# Altium schematic sheet Main.SchDoc: Top level
size A3; Organization: Use Organization_Name in ProjParam; Address1: Eliot Ferragni; Address2: STI-MOBOTS; Address3: EPFL; Address4: CH-1015 LAUSANNE; DocumentNumber: 1; Revision: A; SheetNumber: 1; SheetTotal: 11; ApprovedBy: Init ApprovedBy in DocParam; CheckedBy: Init CheckedBy in DocParam; Author: Init Author in DocParam; CompanyName: Init CompanyName in DocParam; DrawnBy: Init DrawBy in DocParam; Engineer: Init Engineer in DocParam; Title2: Top level interconnections view; DocumentName: Init DocumentName in DocParam; ProjectName: Init ProjectName in DocParam
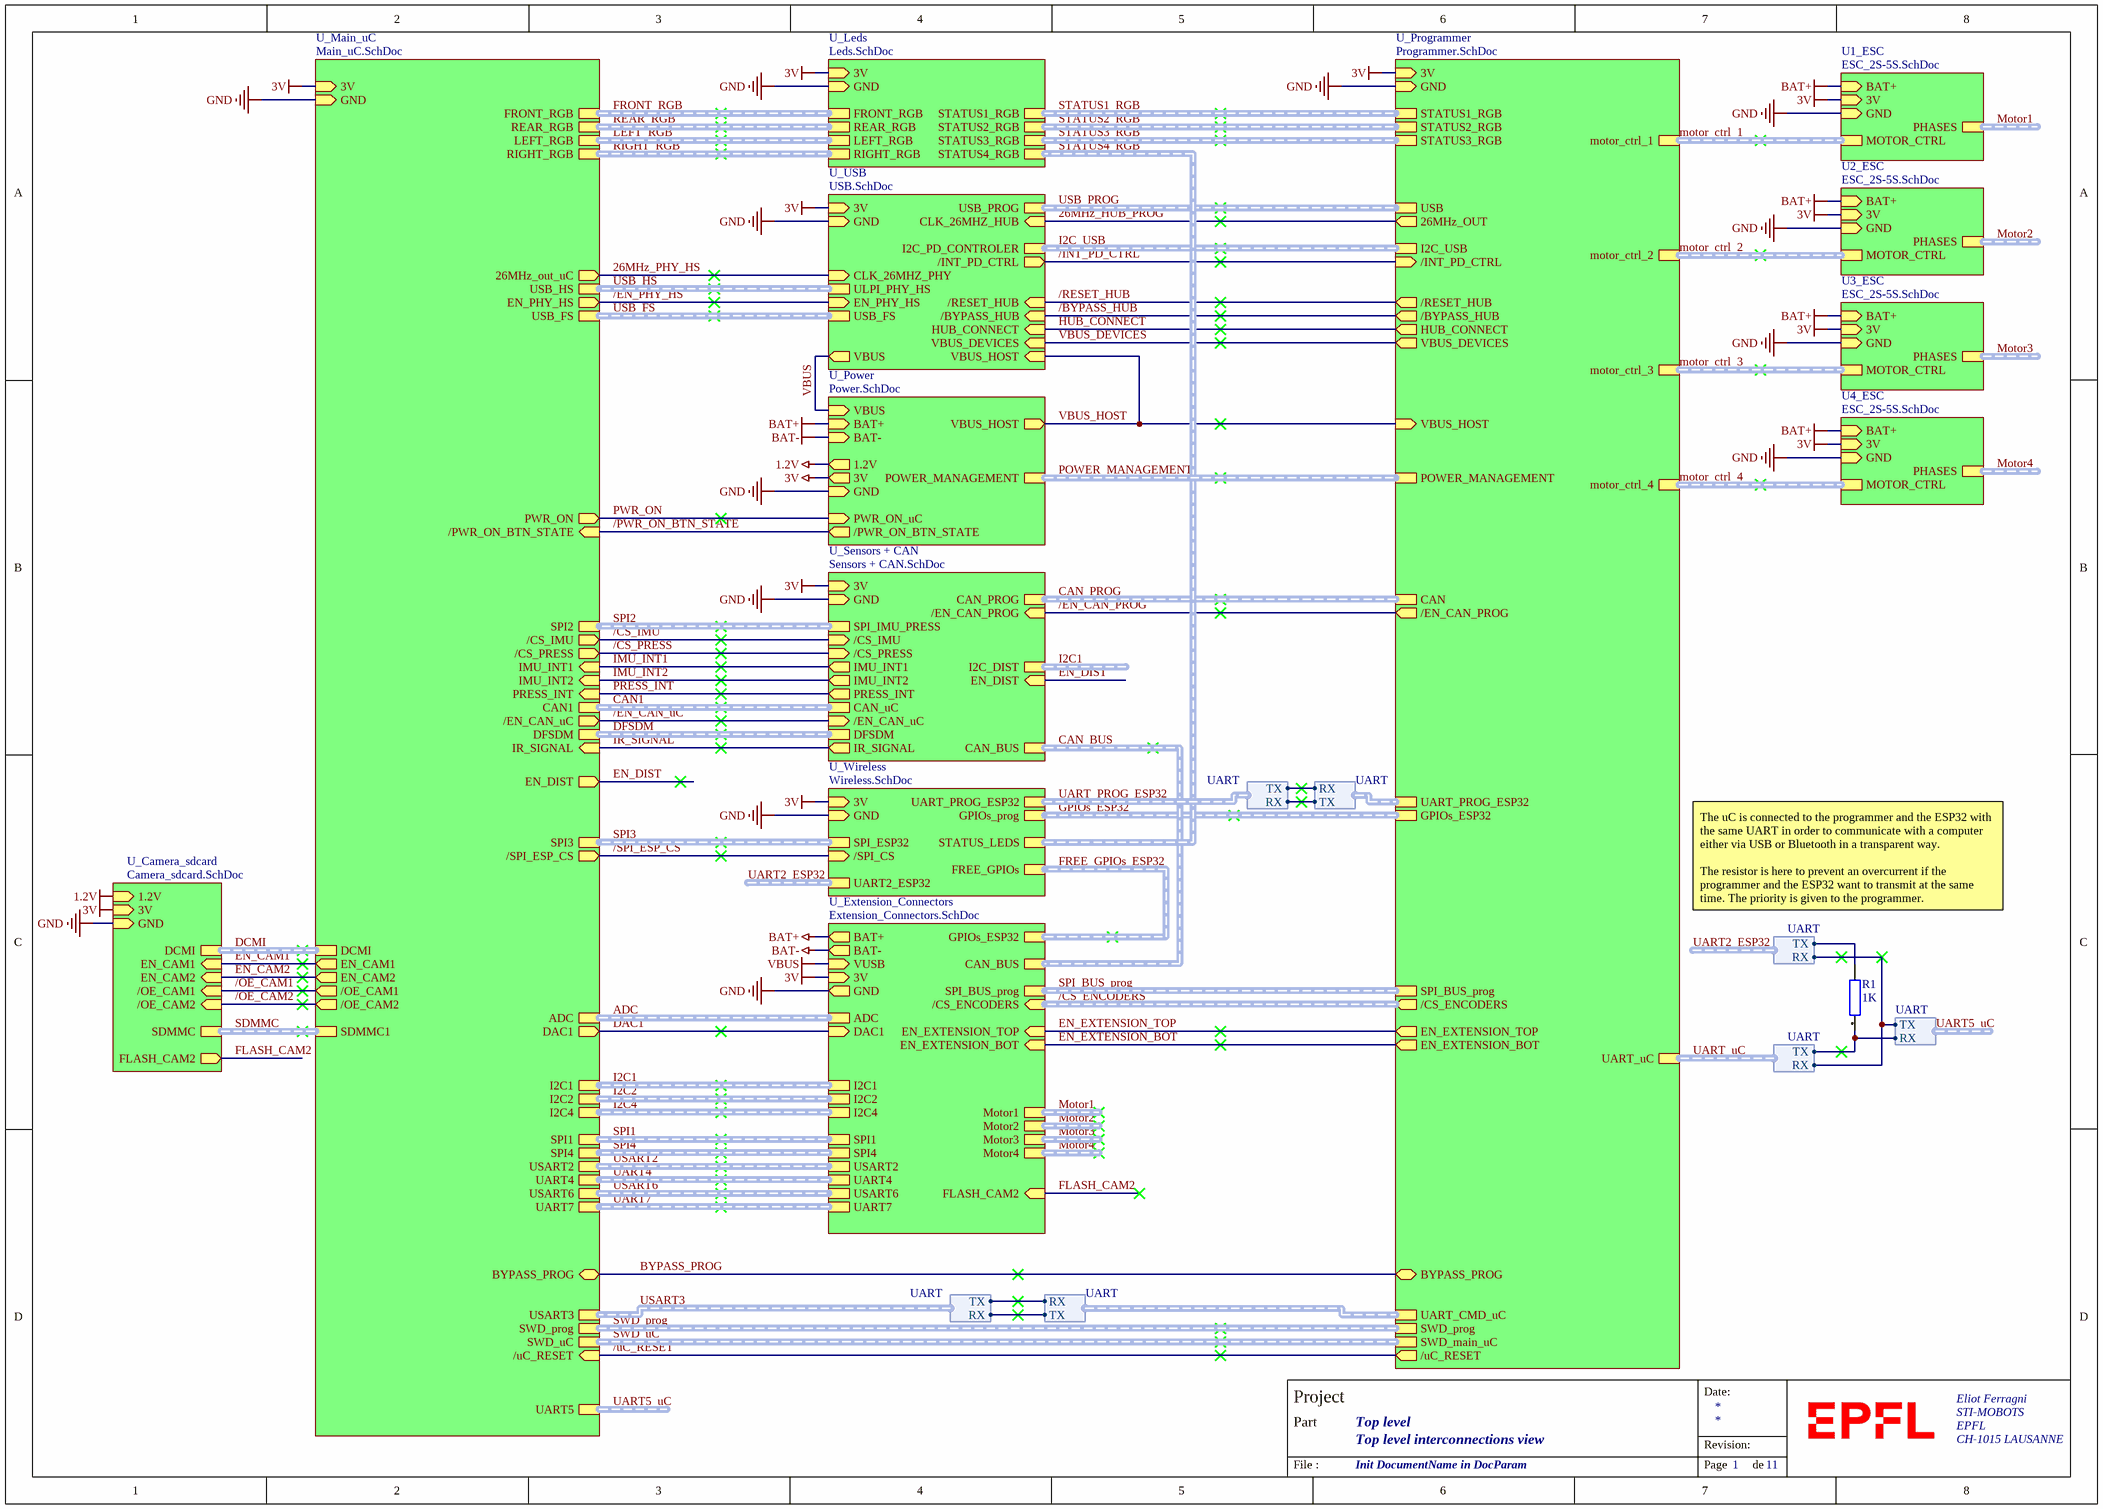
[diagram p0: Main.SchDoc]

## Parts
R1  1K  [RESC0201(0603)_L]

## Sub-sheets
U1_ESC = ESC_2S-5S.SchDoc: MOTOR_CTRL (harness Brushless motor), BAT+ (in), GND (in), 3V (in), PHASES (harness Motor_phases)
U2_ESC = ESC_2S-5S.SchDoc: MOTOR_CTRL (harness Brushless motor), BAT+ (in), GND (in), 3V (in), PHASES (harness Motor_phases)
U3_ESC = ESC_2S-5S.SchDoc: MOTOR_CTRL (harness Brushless motor), BAT+ (in), GND (in), 3V (in), PHASES (harness Motor_phases)
U4_ESC = ESC_2S-5S.SchDoc: MOTOR_CTRL (harness Brushless motor), BAT+ (in), GND (in), 3V (in), PHASES (harness Motor_phases)
U_Camera_sdcard = Camera_sdcard.SchDoc: EN_CAM1 (in), SDMMC (harness SDMMC), 3V (in), GND (in), EN_CAM2 (in), 1.2V (in), /OE_CAM2 (in), /OE_CAM1 (in), DCMI (harness DCMI), FLASH_CAM2 (out)
U_Extension_Connectors = Extension_Connectors.SchDoc: VUSB (in), GND (out), BAT+ (out), 3V (in), I2C1 (harness I2C), I2C2 (harness I2C), I2C4 (harness I2C), SPI4 (harness SPI), UART7 (harness UART_flow_ctrl), USART2 (harness UART), UART4 (harness UART), USART6 (harness UART_flow_ctrl), ADC (harness ADC), DAC1 (in), GPIOs_ESP32 (harness FREE_GPIOs_ESP32), BAT- (out), CAN_BUS (harness CAN_BUS), Motor3 (harness Motor_phases), Motor2 (harness Motor_phases), Motor4 (harness Motor_phases), Motor1 (harness Motor_phases), SPI_BUS_prog (harness SPI), /CS_ENCODERS (in, harness /CS_ENCODERS), SPI1 (harness SPI), EN_EXTENSION_TOP (in), EN_EXTENSION_BOT (in), FLASH_CAM2 (in)
U_Leds = Leds.SchDoc: STATUS1_RGB (harness RGB), STATUS2_RGB (harness RGB), STATUS3_RGB (harness RGB), STATUS4_RGB (harness RGB), FRONT_RGB (harness RGB), REAR_RGB (harness RGB), LEFT_RGB (harness RGB), RIGHT_RGB (harness RGB), 3V (in), GND (in)
U_Main_uC = Main_uC.SchDoc: I2C1 (harness I2C), SWD_uC (harness SWD), CAN1 (harness CAN), USB_FS (harness USB), UART5 (harness UART), FRONT_RGB (harness RGB), DFSDM (harness DFSDM), I2C2 (harness I2C), I2C4 (harness I2C), SWD_prog (harness SWD), 26MHz_out_uC (out), SDMMC1 (harness SDMMC), REAR_RGB (harness RGB), LEFT_RGB (harness RGB), RIGHT_RGB (harness RGB), SPI2 (harness SPI), 3V (in), GND (in), USART3 (harness UART), SPI3 (harness SPI), SPI4 (harness SPI), UART7 (harness UART_flow_ctrl), USART2 (harness UART), UART4 (harness UART), USART6 (harness UART_flow_ctrl), USB_HS (harness ULPI), ADC (harness ADC), /EN_CAN_uC (out), IR_SIGNAL (in), EN_PHY_HS (out), DAC1 (out), /SPI_ESP_CS (out), EN_CAM1 (out), EN_CAM2 (out), /uC_RESET (in), PWR_ON (out), /PWR_ON_BTN_STATE (in), /CS_IMU (out), IMU_INT2 (in), IMU_INT1 (in), /CS_PRESS (out), PRESS_INT (in), SPI1 (harness SPI), EN_DIST (out), /OE_CAM1 (out), /OE_CAM2 (out), BYPASS_PROG (bidir), DCMI (harness DCMI)
U_Power = Power.SchDoc: VBUS (in), BAT+ (in), 3V (out), GND (in), BAT- (in), PWR_ON_uC (in), VBUS_HOST (out), /PWR_ON_BTN_STATE (out), 1.2V (out), POWER_MANAGEMENT (harness Power Management)
U_Programmer = Programmer.SchDoc: CAN (harness CAN), USB (harness USB), I2C_USB (harness I2C), 26MHz_OUT (out), UART_PROG_ESP32 (harness UART), UART_uC (harness UART), SWD_main_uC (harness SWD), /INT_PD_CTRL (in), STATUS1_RGB (harness RGB), STATUS2_RGB (harness RGB), STATUS3_RGB (harness RGB), /EN_CAN_PROG (out), UART_CMD_uC (harness UART), motor_ctrl_2 (harness Brushless motor), motor_ctrl_1 (harness Brushless motor), motor_ctrl_4 (harness Brushless motor), motor_ctrl_3 (harness Brushless motor), SWD_prog (harness SWD), 3V (in), GND (in), GPIOs_ESP32 (harness GPIOs_ESP32_to_prog), /uC_RESET (out), SPI_BUS_prog (harness SPI), /CS_ENCODERS (out, harness /CS_ENCODERS), EN_EXTENSION_TOP (out), EN_EXTENSION_BOT (out), VBUS_DEVICES (out), VBUS_HOST (in), /BYPASS_HUB (out), /RESET_HUB (out), HUB_CONNECT (out), BYPASS_PROG (bidir), POWER_MANAGEMENT (harness Power Management)
U_Sensors + CAN = Sensors + CAN.SchDoc: SPI_IMU_PRESS (harness SPI), IR_SIGNAL (out), CAN_uC (harness CAN), CAN_PROG (harness CAN), CAN_BUS (harness CAN_BUS), /EN_CAN_uC (in), /EN_CAN_PROG (in), 3V (in), GND (in), DFSDM (harness DFSDM), /CS_IMU (in), IMU_INT2 (out), IMU_INT1 (out), /CS_PRESS (in), PRESS_INT (out), I2C_DIST (harness I2C), EN_DIST (in)
U_USB = USB.SchDoc: USB_FS (harness USB), USB_PROG (harness USB), VBUS_DEVICES (in), CLK_26MHZ_HUB (in), ULPI_PHY_HS (harness ULPI), CLK_26MHZ_PHY (in), EN_PHY_HS (in), /INT_PD_CTRL (out), VBUS (out), I2C_PD_CONTROLER (harness I2C), 3V (in), GND (in), /BYPASS_HUB (in), /RESET_HUB (in), HUB_CONNECT (in), VBUS_HOST (in)
U_Wireless = Wireless.SchDoc: UART_PROG_ESP32 (harness UART), SPI_ESP32 (harness SPI), UART2_ESP32 (harness UART), STATUS_LEDS (harness RGB), 3V (in), GND (in), /SPI_CS (in), FREE_GPIOs (harness FREE_GPIOs_ESP32), GPIOs_prog (harness GPIOs_ESP32_to_prog)

## Harnesses
UART: RX, TX

## Nets
1.2V: sheet U_Power/1.2V, sheet U_Camera_sdcard/1.2V
3V: sheet U_Programmer/3V, sheet U_Power/3V, sheet U_USB/3V, sheet U_Leds/3V, sheet U_Sensors + CAN/3V, sheet U_Wireless/3V, sheet U_Main_uC/3V, sheet U_Extension_Connectors/3V, sheet U1_ESC/3V, sheet U2_ESC/3V, sheet U3_ESC/3V, sheet U4_ESC/3V, sheet U_Camera_sdcard/3V
BAT+: sheet U_Power/BAT+, sheet U_Extension_Connectors/BAT+, sheet U1_ESC/BAT+, sheet U2_ESC/BAT+, sheet U3_ESC/BAT+, sheet U4_ESC/BAT+
BAT-: sheet U_Power/BAT-, sheet U_Extension_Connectors/BAT-
GND: sheet U_Programmer/GND, sheet U_Power/GND, sheet U_USB/GND, sheet U_Leds/GND, sheet U_Sensors + CAN/GND, sheet U_Wireless/GND, sheet U_Main_uC/GND, sheet U_Extension_Connectors/GND, sheet U1_ESC/GND, sheet U2_ESC/GND, sheet U3_ESC/GND, sheet U4_ESC/GND, sheet U_Camera_sdcard/GND
VBUS: sheet U_Power/VBUS, sheet U_USB/VBUS, sheet U_Extension_Connectors/VUSB
26MHz_HUB_PROG: sheet U_Programmer/26MHz_OUT, sheet U_USB/CLK_26MHZ_HUB
26MHz_PHY_HS: sheet U_USB/CLK_26MHZ_PHY, sheet U_Main_uC/26MHz_out_uC
/BYPASS_HUB: sheet U_Programmer//BYPASS_HUB, sheet U_USB//BYPASS_HUB
/CS_IMU: sheet U_Sensors + CAN//CS_IMU, sheet U_Main_uC//CS_IMU
/CS_PRESS: sheet U_Sensors + CAN//CS_PRESS, sheet U_Main_uC//CS_PRESS
/EN_CAN_PROG: sheet U_Programmer//EN_CAN_PROG, sheet U_Sensors + CAN//EN_CAN_PROG
/EN_CAN_uC: sheet U_Sensors + CAN//EN_CAN_uC, sheet U_Main_uC//EN_CAN_uC
/EN_PHY_HS: sheet U_USB/EN_PHY_HS, sheet U_Main_uC/EN_PHY_HS
/INT_PD_CTRL: sheet U_Programmer//INT_PD_CTRL, sheet U_USB//INT_PD_CTRL
/OE_CAM1: sheet U_Main_uC//OE_CAM1, sheet U_Camera_sdcard//OE_CAM1
/OE_CAM2: sheet U_Main_uC//OE_CAM2, sheet U_Camera_sdcard//OE_CAM2
/PWR_ON_BTN_STATE: sheet U_Power//PWR_ON_BTN_STATE, sheet U_Main_uC//PWR_ON_BTN_STATE
/RESET_HUB: sheet U_Programmer//RESET_HUB, sheet U_USB//RESET_HUB
/SPI_ESP_CS: sheet U_Wireless//SPI_CS, sheet U_Main_uC//SPI_ESP_CS
/uC_RESET: sheet U_Programmer//uC_RESET, sheet U_Main_uC//uC_RESET
BYPASS_PROG: sheet U_Programmer/BYPASS_PROG, sheet U_Main_uC/BYPASS_PROG
DAC1: sheet U_Main_uC/DAC1, sheet U_Extension_Connectors/DAC1
EN_CAM1: sheet U_Main_uC/EN_CAM1, sheet U_Camera_sdcard/EN_CAM1
EN_CAM2: sheet U_Main_uC/EN_CAM2, sheet U_Camera_sdcard/EN_CAM2
EN_DIST: sheet U_Sensors + CAN/EN_DIST, sheet U_Main_uC/EN_DIST
EN_EXTENSION_BOT: sheet U_Programmer/EN_EXTENSION_BOT, sheet U_Extension_Connectors/EN_EXTENSION_BOT
EN_EXTENSION_TOP: sheet U_Programmer/EN_EXTENSION_TOP, sheet U_Extension_Connectors/EN_EXTENSION_TOP
FLASH_CAM2: sheet U_Extension_Connectors/FLASH_CAM2, sheet U_Camera_sdcard/FLASH_CAM2
HUB_CONNECT: sheet U_Programmer/HUB_CONNECT, sheet U_USB/HUB_CONNECT
IMU_INT1: sheet U_Sensors + CAN/IMU_INT1, sheet U_Main_uC/IMU_INT1
IMU_INT2: sheet U_Sensors + CAN/IMU_INT2, sheet U_Main_uC/IMU_INT2
IR_SIGNAL: sheet U_Sensors + CAN/IR_SIGNAL, sheet U_Main_uC/IR_SIGNAL
PRESS_INT: sheet U_Sensors + CAN/PRESS_INT, sheet U_Main_uC/PRESS_INT
PWR_ON: sheet U_Power/PWR_ON_uC, sheet U_Main_uC/PWR_ON
UART2_ESP32.RX: sheet U_Wireless/UART2_ESP32.RX, sheet U_Programmer/UART_uC.RX, sheet U_Main_uC/UART5.TX
UART2_ESP32.TX: R1.2 ; sheet U_Wireless/UART2_ESP32.TX
UART5_uC.RX: R1.1 ; sheet U_Programmer/UART_uC.TX, sheet U_Main_uC/UART5.RX
UART_PROG_ESP32.RX: sheet U_Wireless/UART_PROG_ESP32.RX, sheet U_Programmer/UART_PROG_ESP32.TX
UART_PROG_ESP32.TX: sheet U_Wireless/UART_PROG_ESP32.TX, sheet U_Programmer/UART_PROG_ESP32.RX
USART3.RX: sheet U_Main_uC/USART3.RX, sheet U_Programmer/UART_CMD_uC.TX
USART3.TX: sheet U_Main_uC/USART3.TX, sheet U_Programmer/UART_CMD_uC.RX
VBUS_DEVICES: sheet U_Programmer/VBUS_DEVICES, sheet U_USB/VBUS_DEVICES
VBUS_HOST: sheet U_Programmer/VBUS_HOST, sheet U_Power/VBUS_HOST, sheet U_USB/VBUS_HOST

## Buses and harness runs
harness /CS_ENCODERS = sheet U_Extension_Connectors//CS_ENCODERS = sheet U_Programmer//CS_ENCODERS
harness ADC = sheet U_Extension_Connectors/ADC = sheet U_Main_uC/ADC
harness CAN1 = sheet U_Main_uC/CAN1 = sheet U_Sensors + CAN/CAN_uC
harness CAN_BUS = sheet U_Extension_Connectors/CAN_BUS = sheet U_Sensors + CAN/CAN_BUS
harness CAN_PROG = sheet U_Programmer/CAN = sheet U_Sensors + CAN/CAN_PROG
harness DCMI = sheet U_Camera_sdcard/DCMI = sheet U_Main_uC/DCMI
harness DFSDM = sheet U_Main_uC/DFSDM = sheet U_Sensors + CAN/DFSDM
harness FREE_GPIOs_ESP32 = sheet U_Extension_Connectors/GPIOs_ESP32 = sheet U_Wireless/FREE_GPIOs
harness FRONT_RGB = sheet U_Leds/FRONT_RGB = sheet U_Main_uC/FRONT_RGB
harness GPIOs_ESP32 = sheet U_Programmer/GPIOs_ESP32 = sheet U_Wireless/GPIOs_prog
harness I2C1 = sheet U_Extension_Connectors/I2C1 = sheet U_Main_uC/I2C1
harness I2C1 = sheet U_Sensors + CAN/I2C_DIST
harness I2C2 = sheet U_Extension_Connectors/I2C2 = sheet U_Main_uC/I2C2
harness I2C4 = sheet U_Extension_Connectors/I2C4 = sheet U_Main_uC/I2C4
harness I2C_USB = sheet U_Programmer/I2C_USB = sheet U_USB/I2C_PD_CONTROLER
harness LEFT_RGB = sheet U_Leds/LEFT_RGB = sheet U_Main_uC/LEFT_RGB
harness Motor1 = sheet U1_ESC/PHASES
harness Motor1 = sheet U_Extension_Connectors/Motor1
harness Motor2 = sheet U2_ESC/PHASES
harness Motor2 = sheet U_Extension_Connectors/Motor2
harness Motor3 = sheet U3_ESC/PHASES
harness Motor3 = sheet U_Extension_Connectors/Motor3
harness Motor4 = sheet U4_ESC/PHASES
harness Motor4 = sheet U_Extension_Connectors/Motor4
harness motor_ctrl_1 = sheet U1_ESC/MOTOR_CTRL = sheet U_Programmer/motor_ctrl_1
harness motor_ctrl_2 = sheet U2_ESC/MOTOR_CTRL = sheet U_Programmer/motor_ctrl_2
harness motor_ctrl_3 = sheet U3_ESC/MOTOR_CTRL = sheet U_Programmer/motor_ctrl_3
harness motor_ctrl_4 = sheet U4_ESC/MOTOR_CTRL = sheet U_Programmer/motor_ctrl_4
harness POWER_MANAGEMENT = sheet U_Power/POWER_MANAGEMENT = sheet U_Programmer/POWER_MANAGEMENT
harness REAR_RGB = sheet U_Leds/REAR_RGB = sheet U_Main_uC/REAR_RGB
harness RIGHT_RGB = sheet U_Leds/RIGHT_RGB = sheet U_Main_uC/RIGHT_RGB
harness SDMMC = sheet U_Camera_sdcard/SDMMC = sheet U_Main_uC/SDMMC1
harness SPI1 = sheet U_Extension_Connectors/SPI1 = sheet U_Main_uC/SPI1
harness SPI2 = sheet U_Main_uC/SPI2 = sheet U_Sensors + CAN/SPI_IMU_PRESS
harness SPI3 = sheet U_Main_uC/SPI3 = sheet U_Wireless/SPI_ESP32
harness SPI4 = sheet U_Extension_Connectors/SPI4 = sheet U_Main_uC/SPI4
harness SPI_BUS_prog = sheet U_Extension_Connectors/SPI_BUS_prog = sheet U_Programmer/SPI_BUS_prog
harness STATUS1_RGB = sheet U_Leds/STATUS1_RGB = sheet U_Programmer/STATUS1_RGB
harness STATUS2_RGB = sheet U_Leds/STATUS2_RGB = sheet U_Programmer/STATUS2_RGB
harness STATUS3_RGB = sheet U_Leds/STATUS3_RGB = sheet U_Programmer/STATUS3_RGB
harness STATUS4_RGB = sheet U_Leds/STATUS4_RGB = sheet U_Wireless/STATUS_LEDS
harness SWD_prog = sheet U_Main_uC/SWD_prog = sheet U_Programmer/SWD_prog
harness SWD_uC = sheet U_Main_uC/SWD_uC = sheet U_Programmer/SWD_main_uC
harness UART2_ESP32 = sheet U_Wireless/UART2_ESP32
harness UART4 = sheet U_Extension_Connectors/UART4 = sheet U_Main_uC/UART4
harness UART5_uC = sheet U_Main_uC/UART5
harness UART7 = sheet U_Extension_Connectors/UART7 = sheet U_Main_uC/UART7
harness UART_PROG_ESP32 = sheet U_Wireless/UART_PROG_ESP32
harness UART_uC = sheet U_Programmer/UART_uC
harness USART2 = sheet U_Extension_Connectors/USART2 = sheet U_Main_uC/USART2
harness USART3 = sheet U_Main_uC/USART3
harness USART6 = sheet U_Extension_Connectors/USART6 = sheet U_Main_uC/USART6
harness USB_FS = sheet U_Main_uC/USB_FS = sheet U_USB/USB_FS
harness USB_HS = sheet U_Main_uC/USB_HS = sheet U_USB/ULPI_PHY_HS
harness USB_PROG = sheet U_Programmer/USB = sheet U_USB/USB_PROG

## Notes on the sheet
- The uC is connected to the programmer and the ESP32 with the same UART in order to communicate with a computer either via USB or Bluetooth in a transparent way.
  The resistor is here to prevent an overcurrent if the programmer and the ESP32 want to transmit at the same time. The priority is given to the programmer.
- Date:
- Project
- Part
- Revision:
- File :
- Page
- de

## Library data of the parts
R1 = TBD[[/\]]0201[[/\]]1: Resistor 0201; Preference: 1; Currentie: CHF; Note: To buy by assembler; Size: 0201; Footprint Acort: 0201; ROHS: True; DateLastUpdate: 2018-10-19 / 9:06:49 AM; Type: SMD; Manufacturer: -; Manufacturer part number: -; Package / Case: Resistor 0201